# Altium schematic sheet IMU.SchDoc: IMU
size A4; Author: Vamsi Krishna Sesham; DrawnBy: Vamsi Krishna Sesham; Engineer: Vamsi Krishna Sesham; Revision: v1.0; SheetNumber: 6; SheetTotal: 6
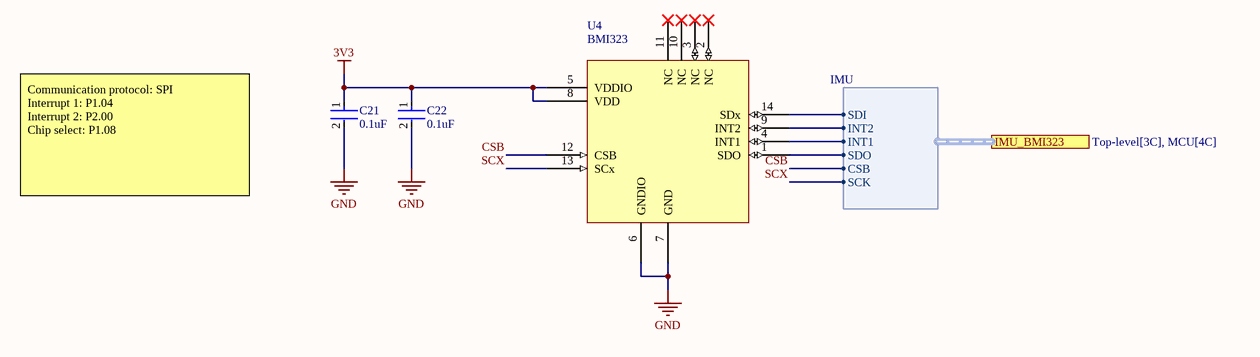
[diagram p0: IMU.SchDoc]

## Parts
C21  0.1uF  [FP-GRM033-0_03-MFG]
C22  0.1uF  [FP-GRM033-0_03-MFG]
U4  BMI323  [BMI323]

## Ports
IMU_BMI323 (harness IMU, see Top-level[3C], MCU[4C])

## Harnesses
IMU: SDI, INT2, INT1, SDO, CSB, SCK

## Nets
3V3: C21.1 C22.1 U4.5(VDDIO) U4.8(VDD)
GND: C21.2 C22.2 U4.6(GNDIO) U4.7(GND)
CSB: U4.12(CSB) ; port IMU_BMI323.CSB
SCX: U4.13(SCx) ; port IMU_BMI323.SCK
NetU4_1: U4.1(SDO) ; port IMU_BMI323.SDO
NetU4_4: U4.4(INT1) ; port IMU_BMI323.INT1
NetU4_9: U4.9(INT2) ; port IMU_BMI323.INT2
NetU4_14: U4.14(SDx) ; port IMU_BMI323.SDI

Not connected (* = marked no-connect by the designer): U4 2(NC)* 3(NC)* 10(NC)* 11(NC)*

## Notes on the sheet
- Communication protocol: SPI
  Interrupt 1: P1.04
  Interrupt 2: P2.00
  Chip select: P1.08

## Library data of the parts
C21 C22 = CMP-06035-019037-1: Chip Multilayer Ceramic Capacitors for General Purpose, 0201, 0.10uF, X7S, 22%, 10%, 16V; Capacitance: 100nF; Dielectric: X7S; Tolerance: 10%; Voltage Rating (DC): 16V; Height: 0.3mm; Max Operating Temperature: 125°C; Case Code (Metric): 0603; Termination: SMD/SMT; Min Operating Temperature: -55°C; Mount: Surface Mount; Case/Package: 0201; Weight: 1.2E-05oz; Package Quantity: 15000; Length: 0.024inch; Voltage Rating: 16V; Case Code (Imperial): 0201; Packaging: Tape and Reel; Thickness: 0.013inch; Width: 0.3mm
U4 = BMI323: BMI323 / IMU combining accelerometer and gyroscope / Accelerometer (A): 16-bit / ±2 g: 16384 LSB/g / ±4 g: 8192 LSB/g / ±8 g: 4096 LSB/g / ±16 g: 2048 LSB/g / Gyroscope (G): 16-bit / ±125 °/s: 262.1 LSB/°/s / ±250 °/s: 131.1 LSB/°/s / ±500 °/s: 65.5 LSB/°/s / ±1000 °/s: 32.8 LSB/°/s / ±2000 °/s: 16.4 LSB/°/s / Output data rate (ODR) / (A): 12.5 Hz … 6.4 kHz / (G): 25 Hz … 6.4 kHz